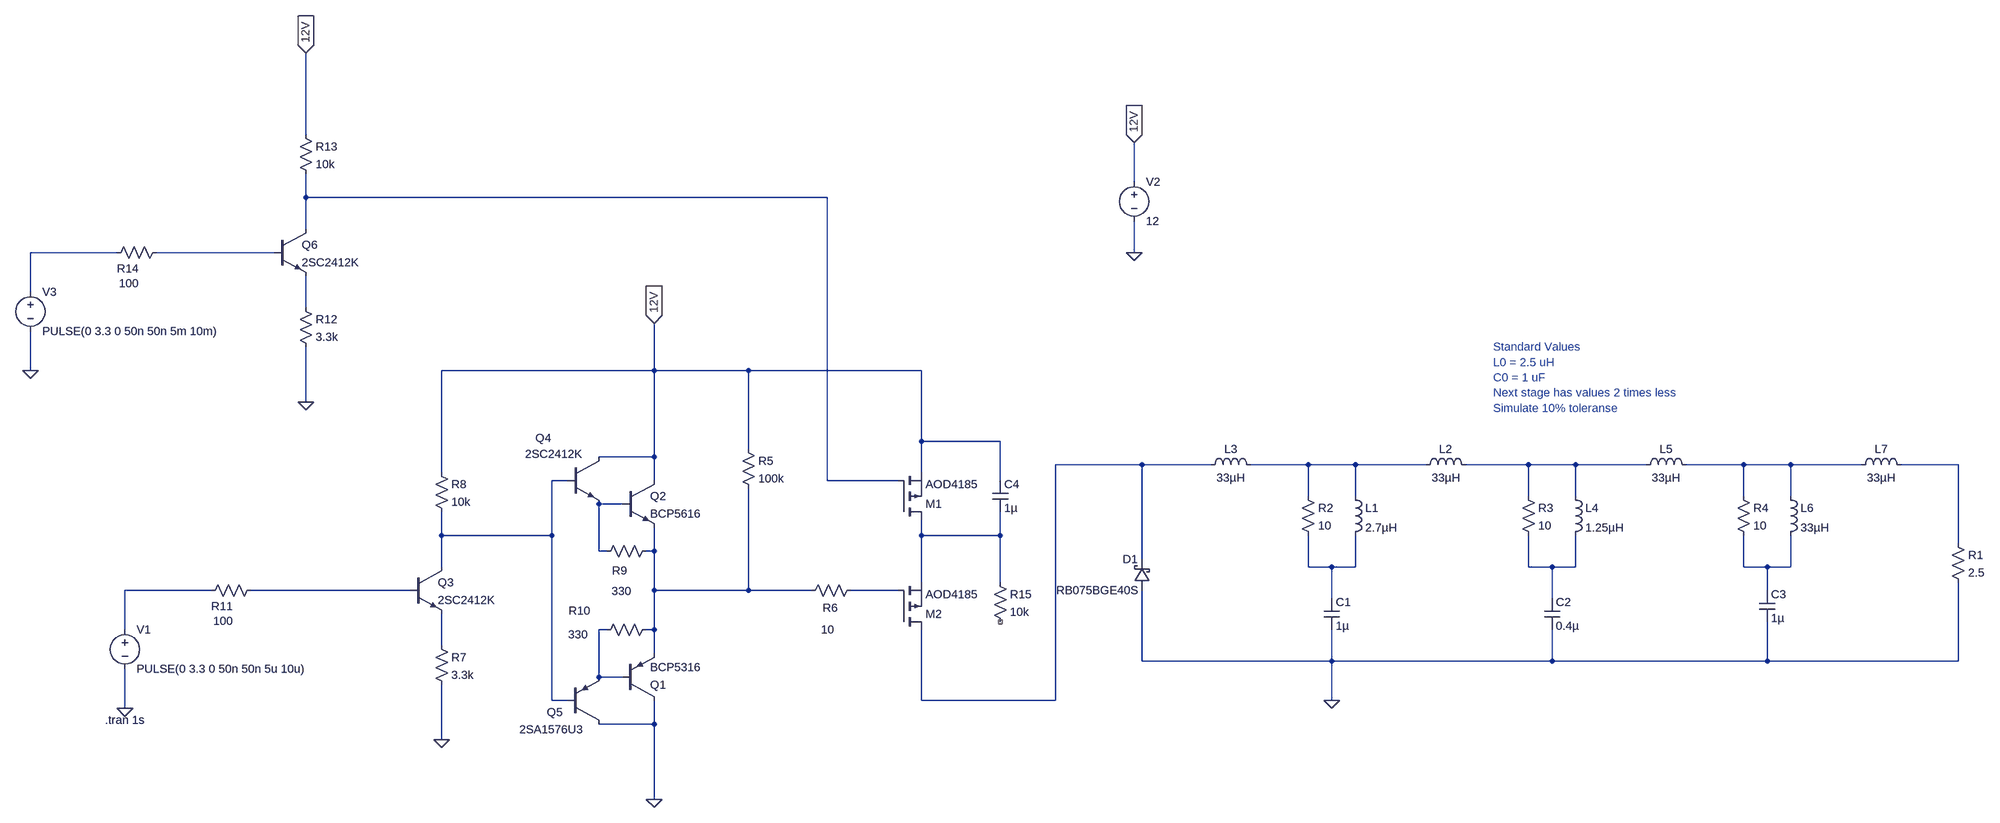
[diagram p0: schematic PWM_concept_08_sw.asc]
PWM_concept_08_sw.asc, the LTspice schematic file:
Version 4
SHEET 1 3368 836
WIRE -1696 -656 -1696 -864
WIRE 48 -560 48 -640
WIRE -1696 -528 -1696 -576
WIRE -576 -528 -1696 -528
WIRE -1696 -464 -1696 -528
WIRE -2080 -416 -2256 -416
WIRE -1760 -416 -2000 -416
WIRE 48 -416 48 -480
WIRE -2256 -336 -2256 -416
WIRE -1696 -304 -1696 -368
WIRE -2256 -176 -2256 -256
WIRE -928 -176 -928 -272
WIRE -928 -176 -1360 -176
WIRE -736 -176 -928 -176
WIRE -384 -176 -736 -176
WIRE -1696 -112 -1696 -224
WIRE -384 -32 -384 -176
WIRE -224 -32 -384 -32
WIRE -736 -16 -736 -176
WIRE -928 0 -928 -176
WIRE -928 0 -1040 0
WIRE 64 16 -112 16
WIRE 208 16 64 16
WIRE 432 16 288 16
WIRE 528 16 432 16
WIRE 672 16 528 16
WIRE 880 16 752 16
WIRE 976 16 880 16
WIRE 1120 16 976 16
WIRE 1344 16 1200 16
WIRE 1440 16 1344 16
WIRE 1584 16 1440 16
WIRE 1792 16 1664 16
WIRE -1360 32 -1360 -176
WIRE -384 32 -384 -32
WIRE -1104 48 -1136 48
WIRE -928 48 -928 0
WIRE -576 48 -576 -528
WIRE -432 48 -576 48
WIRE -224 48 -224 -32
WIRE 432 80 432 16
WIRE 528 80 528 16
WIRE 880 80 880 16
WIRE 976 80 976 16
WIRE 1344 80 1344 16
WIRE 1440 80 1440 16
WIRE -992 96 -1040 96
WIRE -1360 160 -1360 112
WIRE -1136 160 -1136 48
WIRE -1136 160 -1360 160
WIRE -384 160 -384 128
WIRE -224 160 -224 112
WIRE -224 160 -384 160
WIRE 1792 176 1792 16
WIRE -1040 192 -1040 96
WIRE -1024 192 -1040 192
WIRE -928 192 -928 144
WIRE -928 192 -944 192
WIRE 64 208 64 16
WIRE -1360 224 -1360 160
WIRE 432 224 432 160
WIRE 480 224 432 224
WIRE 528 224 528 160
WIRE 528 224 480 224
WIRE 880 224 880 160
WIRE 928 224 880 224
WIRE 976 224 976 160
WIRE 976 224 928 224
WIRE 1344 224 1344 160
WIRE 1392 224 1344 224
WIRE 1440 224 1440 160
WIRE 1440 224 1392 224
WIRE -384 256 -384 160
WIRE -224 256 -224 160
WIRE -1888 272 -2064 272
WIRE -1424 272 -1808 272
WIRE -928 272 -928 192
WIRE -736 272 -736 64
WIRE -736 272 -928 272
WIRE -608 272 -736 272
WIRE -432 272 -528 272
WIRE 1392 272 1392 224
WIRE 480 288 480 224
WIRE 928 288 928 224
WIRE -2064 352 -2064 272
WIRE -1024 352 -1040 352
WIRE -928 352 -928 272
WIRE -928 352 -944 352
WIRE -1360 384 -1360 320
WIRE -928 400 -928 352
WIRE 64 416 64 272
WIRE 480 416 480 352
WIRE 480 416 64 416
WIRE 928 416 928 352
WIRE 928 416 480 416
WIRE 1392 416 1392 336
WIRE 1392 416 928 416
WIRE 1792 416 1792 256
WIRE 1792 416 1392 416
WIRE -1040 448 -1040 352
WIRE -992 448 -1040 448
WIRE -1136 496 -1136 160
WIRE -1104 496 -1136 496
WIRE -384 496 -384 352
WIRE -112 496 -112 16
WIRE -112 496 -384 496
WIRE 480 496 480 416
WIRE -2064 512 -2064 432
WIRE -928 544 -928 496
WIRE -928 544 -1040 544
WIRE -1360 576 -1360 464
WIRE -928 736 -928 544
FLAG -2064 512 0
FLAG 48 -416 0
FLAG -928 -272 12V
IOPIN -928 -272 In
FLAG 48 -640 12V
IOPIN 48 -640 In
FLAG -1360 576 0
FLAG 480 496 0
FLAG -928 736 0
FLAG -1696 -112 0
FLAG -2256 -176 0
FLAG -1696 -864 12V
IOPIN -1696 -864 In
SYMBOL voltage -2064 336 R0
WINDOW 123 0 0 Left 0
WINDOW 39 0 0 Left 0
SYMATTR InstName V1
SYMATTR Value PULSE(0 3.3 0 50n 50n 5u 10u)
SYMBOL res 1776 160 R0
SYMATTR InstName R1
SYMATTR Value 2.5
SYMBOL cap 464 288 R0
SYMATTR InstName C1
SYMATTR Value 1µ
SYMBOL ind 512 64 R0
SYMATTR InstName L1
SYMATTR Value 2.7µH
SYMBOL ind 656 32 R270
WINDOW 0 32 56 VTop 2
WINDOW 3 5 56 VBottom 2
SYMATTR InstName L2
SYMATTR Value 33µH
SYMBOL ind 192 32 R270
WINDOW 0 32 56 VTop 2
WINDOW 3 5 56 VBottom 2
SYMATTR InstName L3
SYMATTR Value 33µH
SYMBOL cap 912 288 R0
SYMATTR InstName C2
SYMATTR Value 0.4µ
SYMBOL ind 960 64 R0
SYMATTR InstName L4
SYMATTR Value 1.25µH
SYMBOL ind 1104 32 R270
WINDOW 0 32 56 VTop 2
WINDOW 3 5 56 VBottom 2
SYMATTR InstName L5
SYMATTR Value 33µH
SYMBOL cap 1376 272 R0
SYMATTR InstName C3
SYMATTR Value 1µ
SYMBOL ind 1424 64 R0
SYMATTR InstName L6
SYMATTR Value 33µH
SYMBOL ind 1568 32 R270
WINDOW 0 32 56 VTop 2
WINDOW 3 5 56 VBottom 2
SYMATTR InstName L7
SYMATTR Value 33µH
SYMBOL res 416 64 R0
SYMATTR InstName R2
SYMATTR Value 10
SYMBOL res 864 64 R0
SYMATTR InstName R3
SYMATTR Value 10
SYMBOL res 1328 64 R0
SYMATTR InstName R4
SYMATTR Value 10
SYMBOL voltage 48 -576 R0
WINDOW 123 0 0 Left 0
WINDOW 39 0 0 Left 0
SYMATTR InstName V2
SYMATTR Value 12
SYMBOL schottky 80 272 R180
WINDOW 0 24 64 Left 2
WINDOW 3 24 0 Left 2
SYMATTR InstName D1
SYMATTR Value RB075BGE40S
SYMATTR Description Diode
SYMATTR Type diode
SYMBOL pnp -992 496 M180
SYMATTR InstName Q1
SYMATTR Value BCP5316
SYMBOL npn -992 48 R0
SYMATTR InstName Q2
SYMATTR Value BCP5616
SYMBOL res -1792 256 R90
WINDOW 0 64 74 VBottom 2
WINDOW 3 63 72 VTop 2
SYMATTR InstName R11
SYMATTR Value 100
SYMBOL npn -1424 224 R0
SYMATTR InstName Q3
SYMATTR Value 2SC2412K
SYMBOL res -1376 368 R0
SYMATTR InstName R7
SYMATTR Value 3.3k
SYMBOL res -1376 16 R0
SYMATTR InstName R8
SYMATTR Value 10k
SYMBOL pmos -432 352 M180
SYMATTR InstName M2
SYMATTR Value AOD4185
SYMBOL res -928 176 R90
WINDOW 0 71 70 VBottom 2
WINDOW 3 82 66 VTop 2
SYMATTR InstName R9
SYMATTR Value 330
SYMBOL res -928 336 R90
WINDOW 0 -7 152 VBottom 2
WINDOW 3 10 154 VTop 2
SYMATTR InstName R10
SYMATTR Value 330
SYMBOL npn -1104 0 R0
WINDOW 0 -65 -38 Left 2
WINDOW 3 -86 -6 Left 2
SYMATTR InstName Q4
SYMATTR Value 2SC2412K
SYMBOL pnp -1104 544 M180
WINDOW 0 -42 24 Left 2
WINDOW 3 -98 -11 Left 2
SYMATTR InstName Q5
SYMATTR Value 2SA1576U3
SYMBOL res -752 -32 R0
SYMATTR InstName R5
SYMATTR Value 100k
SYMBOL res -512 256 R90
WINDOW 0 67 58 VBottom 2
WINDOW 3 80 63 VTop 2
SYMATTR InstName R6
SYMATTR Value 10
SYMBOL pmos -432 128 M180
SYMATTR InstName M1
SYMATTR Value AOD4185
SYMBOL npn -1760 -464 R0
SYMATTR InstName Q6
SYMATTR Value 2SC2412K
SYMBOL res -1712 -320 R0
SYMATTR InstName R12
SYMATTR Value 3.3k
SYMBOL res -1712 -672 R0
SYMATTR InstName R13
SYMATTR Value 10k
SYMBOL voltage -2256 -352 R0
WINDOW 123 0 0 Left 0
WINDOW 39 0 0 Left 0
SYMATTR InstName V3
SYMATTR Value PULSE(0 3.3 0 50n 50n 5m 10m)
SYMBOL res -1984 -432 R90
WINDOW 0 64 74 VBottom 2
WINDOW 3 63 72 VTop 2
SYMATTR InstName R14
SYMATTR Value 100
SYMBOL cap -240 48 R0
SYMATTR InstName C4
SYMATTR Value 1µ
SYMBOL res -240 240 R0
SYMATTR InstName R15
SYMATTR Value 10k
TEXT -2104 536 Left 2 !.tran 1s
TEXT 808 -224 Left 2 ;Standard Values\nL0 = 2.5 uH\nC0 = 1 uF\nNext stage has values 2 times less\nSimulate 10% toleranse

The netlist it stands for:
* PWM_concept_08_sw.asc
V1 N017 0 PULSE(0 3.3 0 50n 50n 5u 10u)
R1 N009 0 2.5
C1 N014 0 1µ
L1 N006 N014 2.7µH
L2 N006 N007 33µH
L3 N005 N006 33µH
C2 N015 0 0.4µ
L4 N007 N015 1.25µH
L5 N007 N008 33µH
C3 N016 0 1µ
L6 N008 N016 33µH
L7 N008 N009 33µH
R2 N006 N014 10
R3 N007 N015 10
R4 N008 N016 10
V2 12V 0 12
D1 0 N005 RB075BGE40S
Q1 0 N020 N013 0 BCP5316
Q2 12V N011 N013 0 BCP5616
R11 N018 N017 100
Q3 N010 N018 N021 0 2SC2412K
R7 N021 0 3.3k
R8 12V N010 10k
M2 N005 N019 N012 N012 AOD4185
R9 N013 N011 330
R10 N013 N020 330
Q4 12V N010 N011 0 2SC2412K
Q5 0 N010 N020 0 2SA1576U3
R5 12V N013 100k
R6 N019 N013 10
M1 N012 N001 12V 12V AOD4185
Q6 N001 N003 N004 0 2SC2412K
R12 N004 0 3.3k
R13 12V N001 10k
V3 N002 0 PULSE(0 3.3 0 50n 50n 5m 10m)
R14 N003 N002 100
C4 12V N012 1µ
R15 N012 NC_01 10k
.model D D
.lib standard.dio
.model NPN NPN
.model PNP PNP
.lib standard.bjt
.model NMOS NMOS
.model PMOS PMOS
.lib standard.mos
.tran 1s
* Standard Values
* L0 = 2.5 uH
* C0 = 1 uF
* Next stage has values 2 times less
* Simulate 10% toleranse
.backanno
.end